# EAGLE design RV8523-RTC-Breakout_v10 (EAGLE 7.5.0)
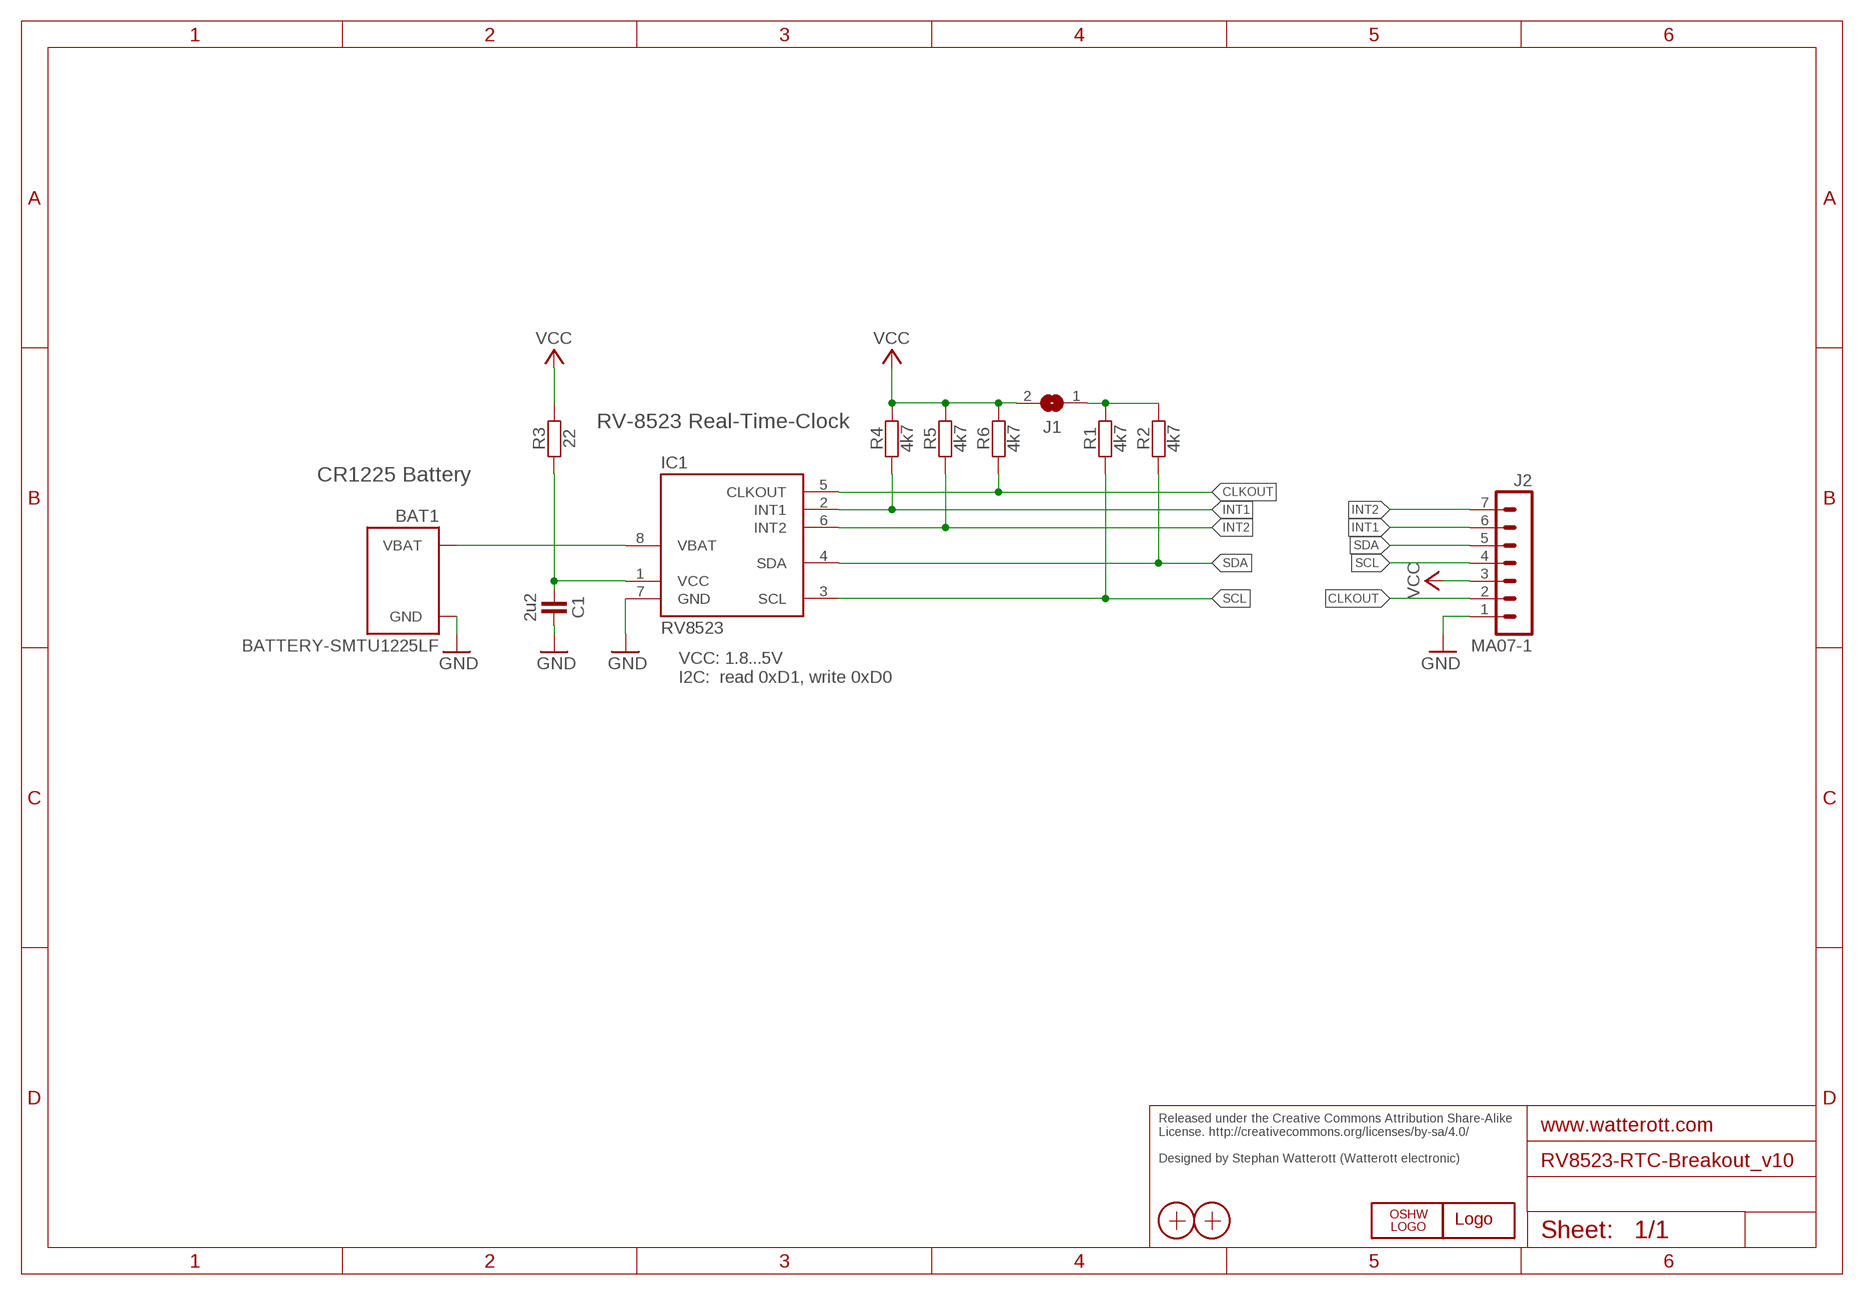
[diagram p0: schematic, sheet 1]

## Parts
BAT1  BATTERY-SMTU1225LF  [BAT-SMTU1225LF]
C1  2u2  CAPACITOR-C0603  [R0603]
IC1  RV8523  RV8523-C3  [RTC-C3]
J1  JUMPER2  [JUMPER2]
J2  MA07-1  [MA07-1]
LOGO1  LOGO-S_PLACE_M  [SPARK_TPLACE_M]
LOGO2  OSHW_LOGOX0070  [OSHW_6X70]
R1  4k7  RESISTOR-R0603  [R0603]
R2  4k7  RESISTOR-R0603  [R0603]
R3  22  RESISTOR-R0603  [R0603]
R4  4k7  RESISTOR-R0603  [R0603]
R5  4k7  RESISTOR-R0603  [R0603]
R6  4k7  RESISTOR-R0603  [R0603]
X1  PASSER-07  [PASSER_07MM]
X2  PASSER-07  [PASSER_07MM]

## Nets
CLKOUT: IC1.5(CLKOUT) J2.2 R6.1
GND: BAT1.-(GND) C1.2 IC1.7(GND) J2.1
I2C_VCC: J1.1 R1.2 R2.2
INT1: IC1.2(INT1) J2.6 R4.1
INT2: IC1.6(INT2) J2.7 R5.1
RV_VCC: C1.1 IC1.1(VCC) R3.1
SCL: IC1.3(SCL) J2.4 R1.1
SDA: IC1.4(SDA) J2.5 R2.1
VBAT: BAT1.+(VBAT) IC1.8(VBAT)
VCC: J1.2 J2.3 R3.2 R4.2 R5.2 R6.2

## Notes on the sheet
- RV-8523 Real-Time-Clock
- CR1225 Battery
- VCC: 1.8...5V
  I2C:  read 0xD1, write 0xD0
- Released under the Creative Commons Attribution Share-Alike 
  License. http://creativecommons.org/licenses/by-sa/4.0/
  
  Designed by Stephan Watterott (Watterott electronic)

## Library data of the parts
BAT1 = we-power:BATTERY: Battery Holder
C1 = we-rcl:CAPACITOR: Capacitors ...2.2uF -> 0603 ...4.7uF -> 0805 ...10uF -> 1206
IC1 = we-chip:RV8523: Micro Crystal RV-8323 RTC (Real Time Clock)
J1 = we-rcl:JUMPER2: 2 Pin Jumpers
J2 = we-con:MA07-1: PIN HEADER; OC_FARNELL: unknown; OC_NEWARK: unknown
LOGO1 = we-symbol:LOGO: Watterott electronic Logo
LOGO2 = we-symbol:OSHW_LOGO: Open-Source-Hardware Logo
R1-R6 = we-rcl:RESISTOR: Resistors all kinds in 0603
X1 X2 = we-symbol:PASSER: Fiducial Markers

## Board
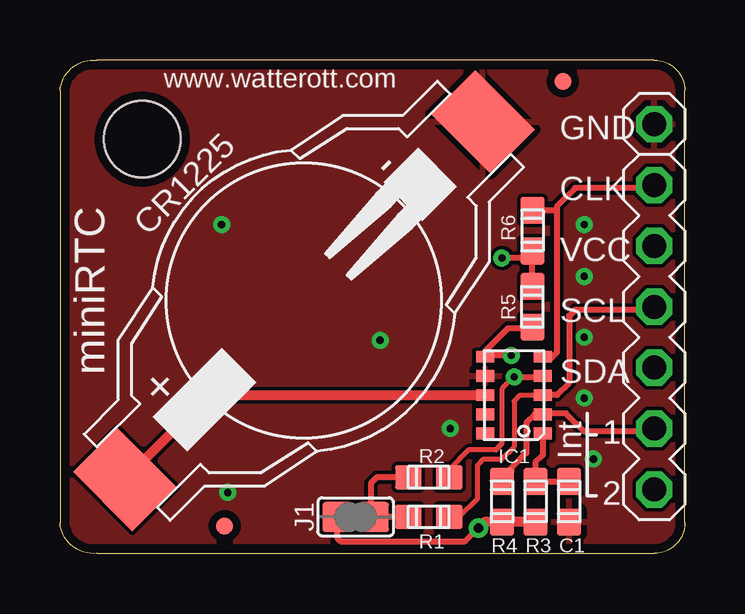
[diagram p1: board, top side]
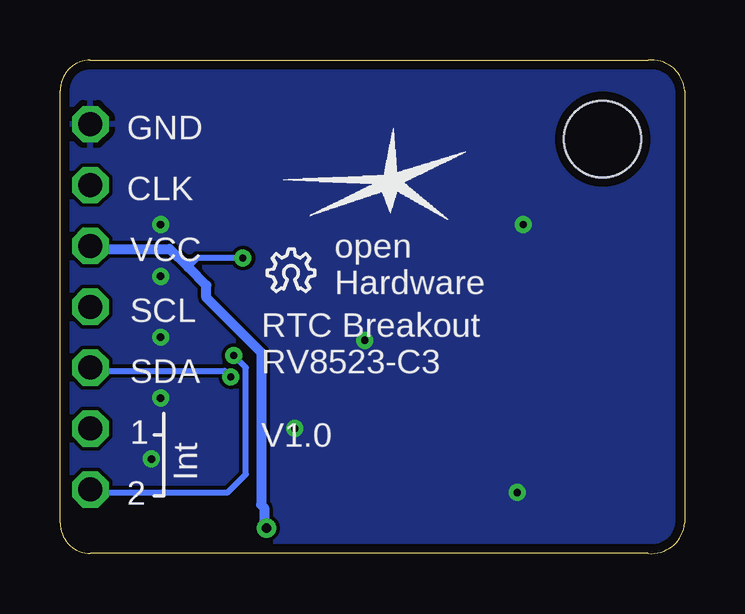
[diagram p2: board, bottom side, seen from below]

Size 26.04 x 20.59 mm. Coordinates in mm from the lower left corner, seen from the top.
Outline: 1.52,0.01 24.77,0.01 arc90 26.04,1.28 26.04,19.31 arc90 24.77,20.58 1.52,20.58 arc90 0,19.31 0,1.28 arc90 1.52,0.01
Copper layers (1*16): Top 0.035mm / dielectric 1.5mm / Bottom 0.035mm
Design rules "default *": minimum track width 6mil, minimum drill 0.3mm, track to track 6mil, track to pad 6mil, pad to pad 6mil, via to via 6mil, smd to smd 1mil, copper to edge 15mil, drill to drill 8mil, minimum pad ring 10mil, minimum via ring 8mil, stop-mask expansion 4mil, vias tented up to drill 0.7mm, thermal gap 10mil
Holes 3.2 mm at 3.43,17.28

### Footprints (pad centres in the part's own frame; a part is rotated, then mirrored left to right if it is on the bottom)
BAT-SMTU1225LF = smd 3.5 x 2.6: + 0,10.55; - 0,-10.55
R0603 = smd 1 x 1.1: 1 0,0.85; 2 0,-0.85
RTC-C3 = smd 0.8 x 0.5: 1 -1.2,1.6; 2 -1.2,0.8; 3 -1.2,0; 4 -1.2,-0.8; 5 -1.2,-1.6; 6 1.2,-1.6; 7 1.2,-0.8; 8 1.2,0; 9 1.2,0.8; 10 1.2,1.6
JUMPER2 = smd 1.25 x 1.25: 1 0,0.76; 2 0,-0.76
MA07-1 = drill 1 octagon: 1 0,7.62; 2 0,5.08; 3 0,2.54; 4 0,0; 5 0,-2.54; 6 0,-5.08; 7 0,-7.62
PASSER_07MM = smd 0.7 x 0.7: X 0,0

### Placement (x,y rotation side)
BAT1  10.16,10.55 135 top
C1  21.21,2.16 0 top
IC1  18.92,6.61 180 top
J1  12.32,1.53 270 top
J2  24.77,10.29 0 top
LOGO1  12.32,15.5 180 bottom
LOGO2  17.4,10.93 0 bottom
R1  15.37,1.53 270 top
R2  15.37,3.18 270 top
R3  19.81,2.16 0 top
R4  18.41,2.16 0 top
R5  19.68,10.29 180 top
R6  19.68,13.47 0 top
X1  20.95,19.69 0 top
X2  6.86,1.15 0 top

### Tracks (layer width: path | path; a pad name or v marks a point on that pad's centre or on a via)
CLKOUT
  Top 0.254: J2.2 24.38,15.37 24.38,15.25 21.46,15.25 20.7,14.48 20.7,14.36 | IC1.5 20.2,8.13 20.45,8.13 20.7,8.39 20.7,14.36 | R6.1 20.66,14.32 20.7,14.36
GND  (via drill 0.3)
  other vias: 6.73,13.72 13.34,8.9 6.99,2.55 21.84,6.48 16.26,5.21 21.84,13.72 21.84,11.56 21.84,9.02 22.23,3.94
  pour Top: 0,20.58 26.04,20.58 26.04,0.01 0,0.01
  pour Bottom: 0,20.58 26.04,20.58 26.04,0.01 0,0.01
I2C_VCC
  Top 0.254: R1.2 J1.1 12.96,1.53 12.95,1.53 12.95,2.93 13.21,3.18 R2.2
INT1
  Top 0.254: J2.6 24.51,5.21 24.51,5.09 21.84,5.09 21.08,5.85 20.16,5.85 IC1.2 19.77,5.81 19.43,5.47 19.43,4.2 18.8,3.56 18.8,3.4 R4.1
INT2  (via drill 0.3)
  Top 0.254: v18.8,8.26 17.77,8.26 IC1.6 17.72,8.46 18.67,9.4 19.65,9.4 R5.1
  Bottom 0.254: J2.7 24.51,2.67 24.51,2.55 19.05,2.55 18.29,3.31 18.29,7.75 v18.8,8.26
RV_VCC
  Top 0.254: IC1.1 20.12,4.13 19.81,3.82 R3.1 C1.1
SCL
  Top 0.2: IC1.3 19.18,6.61 18.92,6.36 18.92,4.45 18.41,3.94 17.65,3.94 17.4,3.69 17.4,2.29 16.64,1.53
  Top 0.203: 16.51,1.57 16.3,1.57 16.26,1.53 16.13,1.53
  Top 0.254: IC1.3 20.7,6.61 21.21,7.12 21.21,9.91 21.46,10.17 24.26,10.17 24.26,10.29 J2.4 | 16.64,1.53 16.26,1.53 R1.1
SDA  (via drill 0.3)
  Top 0.2: v18.92,7.37 18.41,6.86 18.41,4.58 18.16,4.32 17.02,4.32 16.22,3.52
  Top 0.254: v18.92,7.37 20.09,7.37 IC1.4 | 16.22,3.52 R2.1
  Bottom 0.254: J2.5 24.38,7.75 24.38,7.63 19.18,7.63 v18.92,7.37
VBAT
  Top 0.406: 2.45,2.83 2.6,2.99 | 2.6,2.99 BAT1.+ | BAT1.+ 6.22,6.61 IC1.8 | BAT1.+ 2.6,3.09 2.6,2.99
VCC  (via drill 0.3, 0.4)
  Top 0.254: v18.41,12.32 19.39,12.32 R6.2 R5.2 | v17.44,1.06 16.89,0.51 11.68,0.51 11.56,0.64 J1.2
  Top 0.406: R3.2 R4.2 17.69,1.31 v17.44,1.06
  Bottom 0.254: v18.41,12.32 20.32,12.32 20.7,11.94
  Bottom 0.406: J2.3 24.64,12.83 24.64,12.71 21.46,12.71 20.7,11.94 19.94,11.18 19.94,10.67 17.65,8.39 17.65,2.04 17.53,1.91 17.53,1.15 v17.44,1.06

### Text on the board
tPlace: www.watterott.com | GND | CLK | CR1225 | VCC | SCL | miniRTC | SDA | 1 | Int | 2
bPlace: GND | CLK | VCC | open / Hardware | SCL | SDA | 1 | RTC Breakout / RV8523-C3 / / V1.0 | Int | 2
Reference: Silkscreen: 21 bPlace + 22 bPlace